# EAGLE design TonESP (EAGLE 7.7.0)
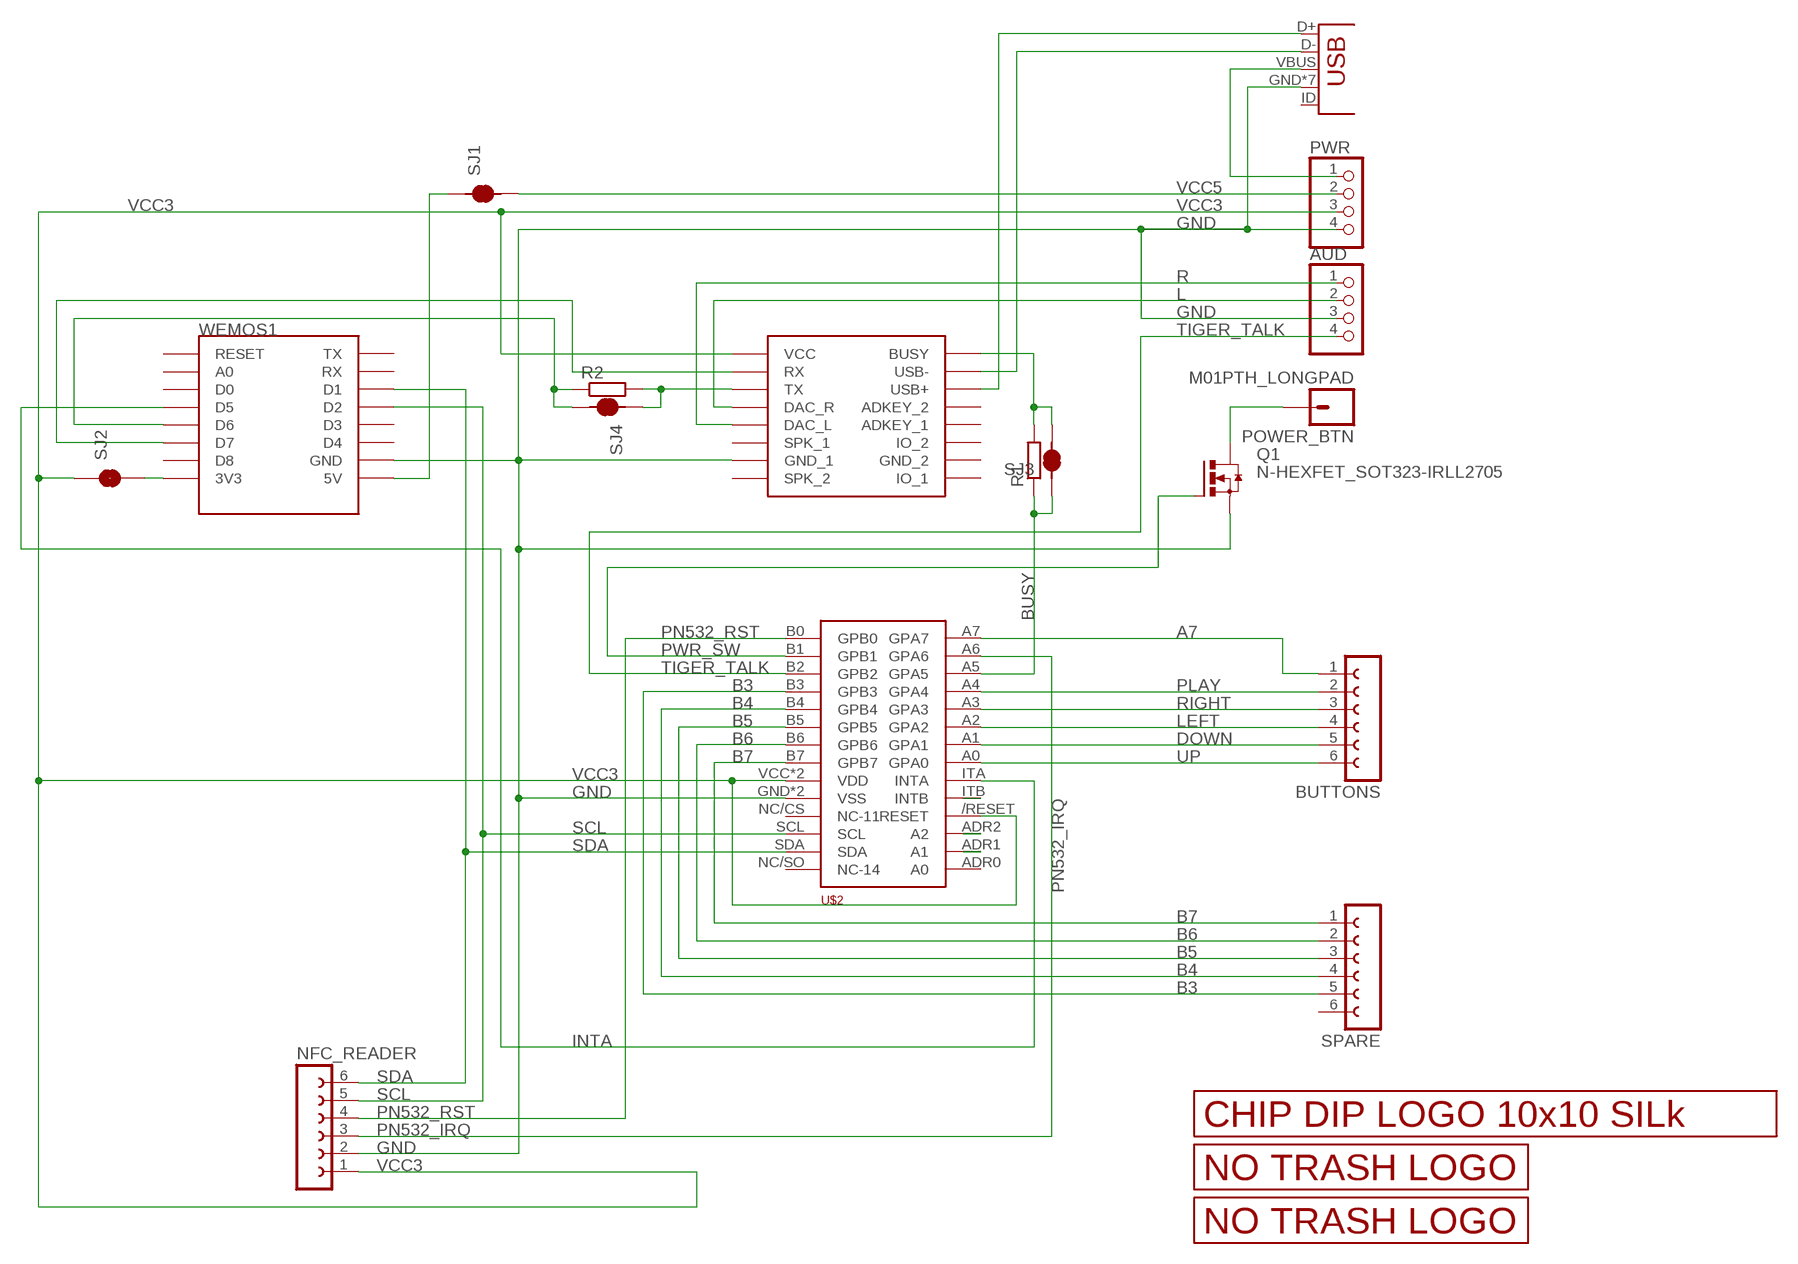
[diagram p0: schematic, sheet 1]

## Parts
AUD  PINHD-1X4  [1X04]
BUTTONS  FE06-1  [FE06]
JP1  USBUSB-MICROB-SMT-DIP  [USB-MICROB-SMT-DIP]
NFC_READER  FE06-1  [FE06]
POWER_BTN  M01PTH_LONGPAD  [1X01_LONGPAD]
PWR  PINHD-1X4  [1X04]
Q1  N-HEXFET_SOT323-IRLL2705  [SOT223]
R1  R-EU_M0805  [M0805]
R2  R-EU_M0805  [M0805]
SJ1  SMD_SJ_2WAY_CLOSEDCLOSED  [SMD_SJ_2WAY_CLOSED]
SJ2  SMD_SJ_2WAY_OPEN  [SMD_SJ_2WAY_OPEN]
SJ3  SMD_SJ_2WAY_CLOSEDCLOSED  [SMD_SJ_2WAY_CLOSED]
SJ4  SMD_SJ_2WAY_CLOSEDCLOSED  [SMD_SJ_2WAY_CLOSED]
SPARE  FE06-1  [FE06]
U$1  DFPLAYER  [DFPLAYER]
U$2  MCP23017-E/SP  [MODULE]
U$4  LOGO_10X10_SILK  [LOGO2_10X10_SILK]
U$5  LOGO_NO_TRASHNO_TRASH  [LOGO_ROHS_NO_TRASH]
U$6  LOGO_NO_TRASHROHS  [LOGO_ROHS_SYM]
WEMOS1  WEMOS-D1-MINITXT  [WEMOS-D1-MINI]

## Nets
A7: BUTTONS.1 U$2.A7(GPA7)
B3: SPARE.5 U$2.B3(GPB3)
B4: SPARE.4 U$2.B4(GPB4)
B5: SPARE.3 U$2.B5(GPB5)
B6: SPARE.2 U$2.B6(GPB6)
B7: SPARE.1 U$2.B7(GPB7)
BUSY: R1.1 SJ3.1 U$2.A5(GPA5)
DOWN: BUTTONS.5 U$2.A1(GPA1)
GND: AUD.3 JP1.GND JP1.MT1(GND) JP1.MT2(GND) JP1.MT3(GND) JP1.MT4(GND) JP1.P$1(GND) JP1.P$2(GND) NFC_READER.2 PWR.4 Q1.3(S) U$1.GND_1 U$2.GND2(VSS) U$2.GND(VSS) WEMOS1.GND
INTA: U$2.ITA(INTA) WEMOS1.D5
L: AUD.2 U$1.DAC_R
LEFT: BUTTONS.4 U$2.A2(GPA2)
N$1: SJ2.3 WEMOS1.3V3
N$3: SJ1.1 WEMOS1.5V
N$4: R1.2 SJ3.3 U$1.BUSY
N$5: R2.2 SJ4.1 U$1.TX
N$6: R2.1 SJ4.3 WEMOS1.D6
N$7: U$1.RX WEMOS1.D7
N$8: POWER_BTN.1 Q1.4(D)
N$9: JP1.VBUS PWR.1
N$11: JP1.D- U$1.USB-
N$12: JP1.D+ U$1.USB+
N$13: U$2.ITB(INTB)
N$14: U$2.ADR2(A2)
N$15: U$2.ADR1(A1)
PLAY: BUTTONS.2 U$2.A4(GPA4)
PN532_IRQ: NFC_READER.3 U$2.A6(GPA6)
PN532_RST: NFC_READER.4 U$2.B0(GPB0)
PWR_SW: Q1.1(G) U$2.B1(GPB1)
R: AUD.1 U$1.DAC_L
RIGHT: BUTTONS.3 U$2.A3(GPA3)
SCL: NFC_READER.5 U$2.SCL WEMOS1.D2
SDA: NFC_READER.6 U$2.SDA WEMOS1.D1
TIGER_TALK: AUD.4 U$2.B2(GPB2)
UP: BUTTONS.6 U$2.A0(GPA0)
VCC3: NFC_READER.1 PWR.3 SJ2.1 U$1.VCC U$2./RESET(RESET) U$2.VCC2(VDD) U$2.VCC(VDD)
VCC5: PWR.2 SJ1.3
Unconnected: JP1.ID SPARE.6 U$1.ADKEY1(ADKEY_1) U$1.ADKEY2(ADKEY_2) U$1.GND_2 U$1.IO1(IO_1) U$1.IO2(IO_2) U$1.SPK1(SPK_1) U$1.SPK2(SPK_2) U$2.ADR0(A0) U$2.NC/CS(NC-11) U$2.NC/SO(NC-14) WEMOS1.A0 WEMOS1.D0 WEMOS1.D3 WEMOS1.D4 WEMOS1.D8 WEMOS1.RESET WEMOS1.RX WEMOS1.TX

## Library data of the parts
AUD PWR = pinhead:PINHD-1X4: PIN HEADER
BUTTONS NFC_READER SPARE = con-lsta:FE06-1: FEMALE HEADER; OC_FARNELL: unknown; OC_NEWARK: unknown
JP1 = JKW_CHIP:USB
POWER_BTN = SparkFun:M01: Header 1 Standard 1-pin 0.1" header. Use with straight break away headers (SKU : PRT-00116), right angle break away headers (PRT-00553), swiss pins (PRT-00743), machine pins (PRT-00117), and female headers (PRT-00115).
Q1 = transistor-power:N-HEXFET_?-*: HEXFET® Power MOSFET
R1 R2 = resistor:R-EU_: RESISTOR, European symbol
SJ1 SJ3 SJ4 = JKW_CHIP:SMD_SJ_2WAY_CLOSED: Solder Jumper 2 way solder jumper
SJ2 = JKW_CHIP:SMD_SJ_2WAY_OPEN: Solder Jumper 2 way solder jumper
U$1 = DFPlayer_v1:DFPLAYER
U$2 = IO-Expanders:MCP23017-E/SP: MCP23017 16 pin IO Expander using I2C bus
U$4 = JKW_CHIP:LOGO_10X10_SILK
U$5 U$6 = JKW_CHIP:LOGO_NO_TRASH
WEMOS1 = esp8266modules:WEMOS-D1-MINI: WeMos.cc D1 mini ESP8266 module

## Board
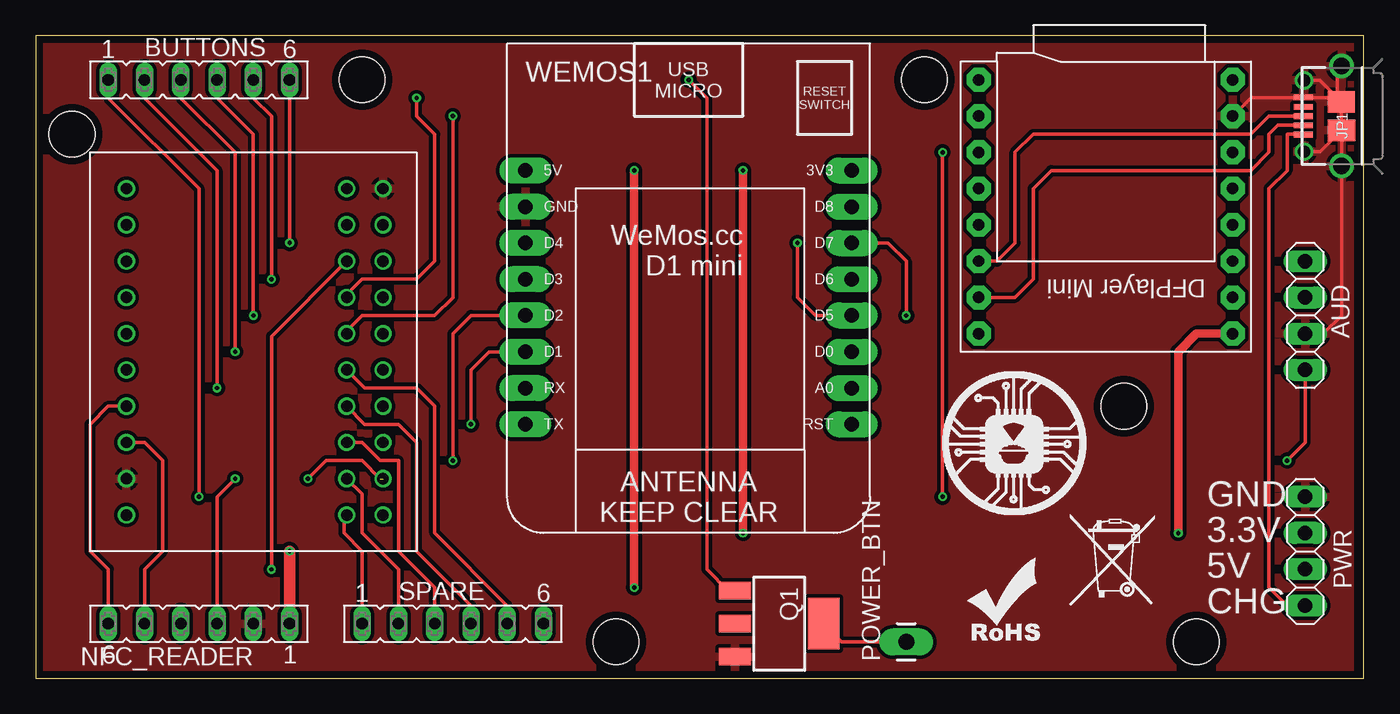
[diagram p1: board, top side]
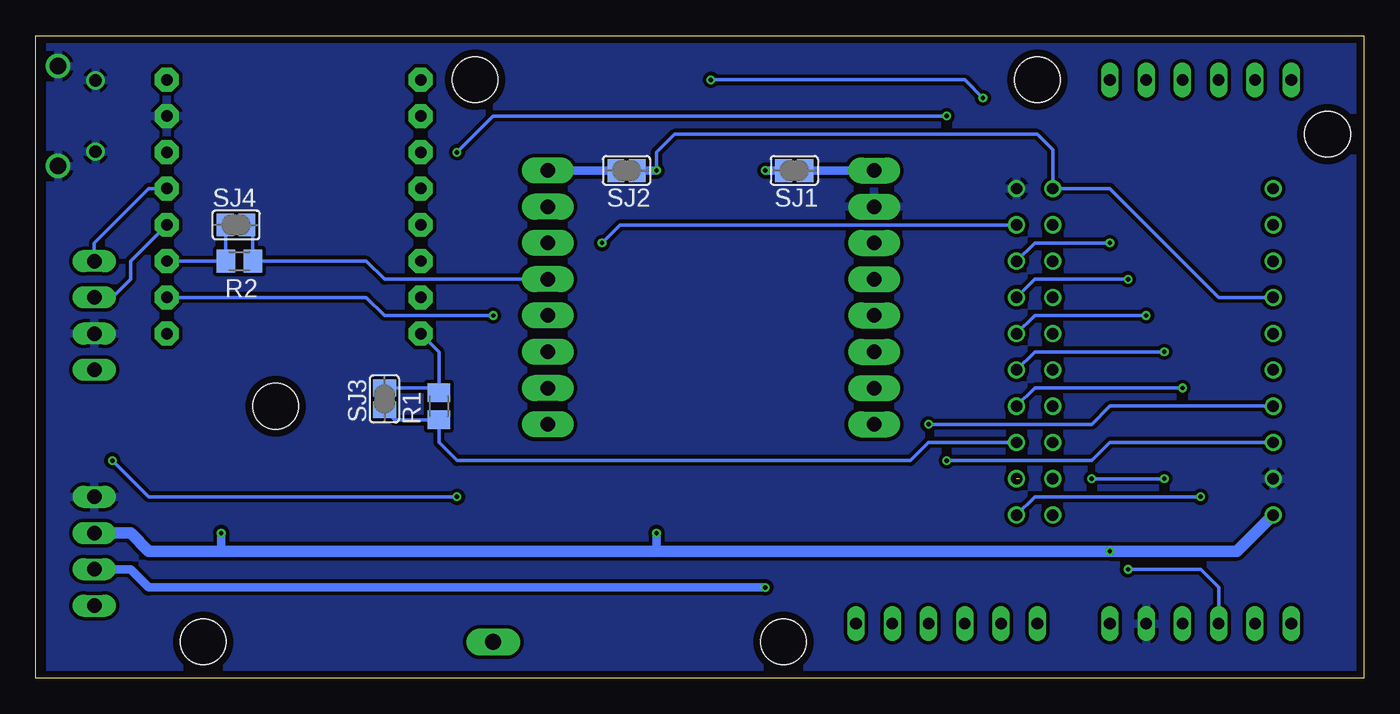
[diagram p2: board, bottom side, seen from below]

Size 93 x 45 mm. Coordinates in mm from the lower left corner, seen from the top.
Outline: 0,0 93,0 93,45 0,45 0,0
Copper layers (1*16): Top 0.035mm / dielectric 1.6mm / Bottom 0.035mm
Design rules "Elecrow_2-layer_PCB_eagle_rule": minimum track width 6mil, minimum drill 12mil, track to track 6mil, track to pad 6mil, pad to pad 6mil, via to via 8mil, smd to smd 0mil, copper to edge 20mil, drill to drill 10mil, minimum pad ring 6mil, minimum via ring 6mil, stop-mask expansion 0mil, vias tented up to drill 100mil, thermal gap 10mil
Holes 3.2 mm at 81.28,2.54 40.64,2.54 62.23,41.91 22.86,41.91 2.54,38.1 76.2,19.05

### Footprints (pad centres in the part's own frame; a part is rotated, then mirrored left to right if it is on the bottom)
1X04 = drill 1.016 long: 1 -3.81,0; 2 -1.27,0; 3 1.27,0; 4 3.81,0
FE06 = drill 0.813 long: 1 -6.35,0; 2 -3.81,0; 3 -1.27,0; 4 1.27,0; 5 3.81,0; 6 6.35,0
USB-MICROB-SMT-DIP = smd 0.4 x 1.35: D+ 0,2.675; D- -0.65,2.675; GND 1.3,2.675; ID 0.65,2.675; VBUS -1.3,2.675 | drill 1.15 pad 1.7: MT1 -3.5,0; MT2 3.5,0 | drill 0.85 pad 1.25: MT3 -2.5,2.625; MT4 2.5,2.625 | smd 1.5 x 1.9: P$1 -1,0; P$2 1,0.01
1X01_LONGPAD = drill 1.118 pad 1.88 long: 1 0,0
SOT223 = smd 1.219 x 2.235: 1 -2.311,-3.099; 2 0,-3.099; 3 2.311,-3.099 | smd 3.6 x 2.2: 4 0,3.099
M0805 = smd 1.3 x 1.6: 1 -0.95,0; 2 0.95,0
SMD_SJ_2WAY_CLOSED = smd 1.168 x 1.6: 1 -1.524,0; 3 0,0
SMD_SJ_2WAY_OPEN = smd 1.168 x 1.6: 1 -1.524,0; 3 0,0
DFPLAYER = drill 0.8 pad 1.676 octagon: ADKEY1 8.89,-1.27; ADKEY2 8.89,1.27; BUSY 8.89,8.89; DAC_L -8.89,-1.27; DAC_R -8.89,1.27; GND_1 -8.89,-6.35; GND_2 8.89,-6.35; IO1 8.89,-8.89; IO2 8.89,-3.81; RX -8.89,6.35; SPK1 -8.89,-3.81; SPK2 -8.89,-8.89; TX -8.89,3.81; USB+ 8.89,3.81; USB- 8.89,6.35; VCC -8.89,8.89
MODULE = drill 0.8: /RESET 0,0; A0 17.966,2.54; A1 17.966,0; A2 17.966,-2.54; A3 17.966,-5.08; A4 17.966,-7.62; A5 17.966,-10.16; A6 17.966,-12.7; A7 17.966,-15.24; ADR0 0,2.54; ADR1 0,5.08; ADR2 0,7.62; B0 15.426,2.54; B1 15.426,0; B2 15.426,-2.54; B3 15.426,-5.08; B4 15.426,-7.62; B5 15.426,-10.16; B6 15.426,-12.7; B7 15.426,-15.24; GND 0,-12.7; GND2 17.966,7.62; ITA 17.966,5.08; ITB 15.426,5.08; NC/CS 0,-5.08; NC/SO 0,-2.54; SCL 0,-10.16; SDA 0,-7.62; VCC 0,-15.24; VCC2 15.426,7.62
WEMOS-D1-MINI = drill 1.016 pad 1.829 long: 3V3 -10.16,-10.16; 5V 12.7,-10.16; A0 -10.16,5.08; D0 -10.16,2.54; D1 12.7,2.54; D2 12.7,0; D3 12.7,-2.54; D4 12.7,-5.08; D5 -10.16,0; D6 -10.16,-2.54; D7 -10.16,-5.08; D8 -10.16,-7.62; GND 12.7,-7.62; RESET -10.16,7.62; RX 12.7,5.08; TX 12.7,7.62

### Placement (x,y rotation side)
AUD  88.9,25.4 270 top
BUTTONS  11.43,41.91 0 top
JP1  91.44,39.37 90 top
NFC_READER  11.43,3.81 180 top
POWER_BTN  60.96,2.54 90 top
PWR  88.9,8.89 90 top
Q1  52.07,3.81 270 top
R1  64.77,19.05 90 bottom
R2  78.74,29.21 180 bottom
SJ1  40.64,35.56 180 bottom
SJ2  52.39,35.56 180 bottom
SJ3  68.58,20.32 90 bottom
SJ4  78.21,31.75 0 bottom
SPARE  29.21,3.81 0 top
U$1  74.93,33.02 180 top
U$2  6.35,26.67 0 top
U$4  63.5,11.43 0 top
U$5  72.39,5.08 0 top
U$6  64.77,2.54 0 top
WEMOS1  46.99,25.4 180 top

### Tracks (layer width: path | path; a pad name or v marks a point on that pad's centre or on a via)
A7  (via drill 0.3)
  Top 0.254: BUTTONS.1 5.08,40.64 11.43,34.29 v11.43,12.7
  Bottom 0.254: v11.43,12.7 23.05,12.7 U$2.A7
B3
  Top 0.254: SPARE.5 33.02,5.08 27.94,10.16 27.94,19.05 26.67,20.32 23.05,20.32 U$2.B3
B4
  Top 0.254: SPARE.4 30.48,5.08 26.67,8.89 26.67,16.51 25.4,17.78 23.05,17.78 U$2.B4
B5
  Top 0.254: SPARE.3 27.94,6.35 25.4,8.89 25.4,15.24 24.13,15.24 22.86,16.51 U$2.B5
B6
  Top 0.254: SPARE.2 25.4,7.62 22.86,10.16 22.86,12.89 U$2.B6
B7
  Top 0.254: SPARE.1 22.86,8.89 21.59,10.16 21.59,11.24 U$2.B7
BUSY
  Bottom 0.254: U$2.A5 30.48,16.51 31.75,15.24 63.5,15.24 64.77,16.51 R1.1 67.88,18.1 SJ3.1
DOWN  (via drill 0.3)
  Top 0.254: BUTTONS.5 15.24,40.64 16.51,39.37 v16.51,27.94
  Bottom 0.254: v16.51,27.94 23.05,27.94 U$2.A1
GND
  Top 0.254: U$1.GND_1 85.12,40.67 JP1.GND 91.13,40.67 | 91.13,40.67 JP1.P$2 | 91.13,40.67 91.13,42.56 JP1.MT2 | JP1.MT4 89.93,41.87 JP1.P$2 | JP1.P$2 JP1.P$1 | JP1.P$1 JP1.MT1 91.44,25.4 90.17,24.13 AUD.3 | JP1.MT3 89.94,36.87 JP1.P$1
  pour Bottom (isolate 0.254): 0,45 92,45 92,0 0,0
  pour Top (isolate 0.254): 0,45 92,45 92,0 0,0
INTA  (via drill 0.3)
  Top 0.254: v53.34,30.48 53.34,26.67 54.61,25.4 WEMOS1.D5
  Bottom 0.254: U$2.ITA 52.07,31.75 v53.34,30.48
L
  Bottom 0.254: U$1.DAC_R 86.36,29.21 86.36,27.94 87.63,26.67 AUD.2
LEFT  (via drill 0.3)
  Top 0.254: BUTTONS.4 12.7,40.64 15.24,38.1 v15.24,25.4
  Bottom 0.254: v15.24,25.4 23.05,25.4 U$2.A2
N$1
  Bottom 0.61: WEMOS1.3V3 SJ2.3
N$3
  Bottom 0.61: WEMOS1.5V SJ1.1
N$4
  Bottom 0.254: SJ3.3 65.09,20.32 R1.2 64.77,22.86 U$1.BUSY
N$5
  Bottom 0.254: U$1.TX R2.2 79.69,30.44 SJ4.1
N$6
  Bottom 0.254: SJ4.3 77.79,31.33 R2.1 69.85,29.21 68.58,27.94 WEMOS1.D6
N$7  (via drill 0.3)
  Top 0.254: WEMOS1.D7 59.69,30.48 60.96,29.21 v60.96,25.4
  Bottom 0.254: v60.96,25.4 68.58,25.4 69.85,26.67 U$1.RX
N$8
  Top 0.254: Q1.4 56.44,2.54 POWER_BTN.1
N$9
  Top 0.254: JP1.VBUS 88.73,38.1 87.63,38.1 87.63,35.56 86.36,34.29 86.36,6.35 87.63,5.08 PWR.1
N$11
  Top 0.254: U$1.USB- 68.58,26.67 69.85,27.94 69.85,34.29 71.12,35.56 85.09,35.56 86.36,36.83 86.36,38.1 86.98,38.72 JP1.D-
N$12
  Top 0.254: U$1.USB+ 67.31,29.21 68.58,30.48 68.58,36.83 69.85,38.1 85.09,38.1 86.36,39.37 JP1.D+
PLAY  (via drill 0.3)
  Top 0.254: BUTTONS.2 7.62,40.64 12.7,35.56 v12.7,20.32
  Bottom 0.254: v12.7,20.32 23.05,20.32 U$2.A4
PN532_IRQ  (via drill 0.3)  (1 unrouted)
  Top 0.254: NFC_READER.3 12.7,12.7 v13.97,13.97 | v19.05,13.97 20.32,15.24 22.86,15.24 24.13,13.97
  Bottom 0.254: v13.97,13.97 v19.05,13.97
PN532_RST  (via drill 0.3)
  Top 0.254: v16.51,7.62 16.51,23.94 U$2.B0
  Bottom 0.254: NFC_READER.4 10.16,6.35 11.43,7.62 v16.51,7.62
PWR_SW  (via drill 0.3)
  Top 0.254: U$2.B1 21.78,26.86 22.86,27.94 26.67,27.94 27.94,29.21 27.94,38.1 26.67,39.37 v26.67,40.64 | Q1.1 48.49,6.12 46.99,7.62 46.99,40.64 v45.72,41.91
  Bottom 0.254: v26.67,40.64 27.94,41.91 v45.72,41.91
R
  Bottom 0.254: U$1.DAC_L 85.09,34.29 88.9,30.48 AUD.1
RIGHT  (via drill 0.3)
  Top 0.254: BUTTONS.3 10.16,40.64 13.97,36.83 v13.97,22.86
  Bottom 0.254: v13.97,22.86 23.05,22.86 U$2.A3
SCL  (via drill 0.3)
  Top 0.254: v29.21,15.24 29.21,24.13 30.48,25.4 WEMOS1.D2 | NFC_READER.5 7.62,7.62 8.89,8.89 8.89,15.24 7.62,16.51 U$2.SCL
  Bottom 0.254: U$2.SCL 17.78,16.51 19.05,15.24 v29.21,15.24
SDA  (via drill 0.3)
  Top 0.254: v30.48,17.78 30.48,21.59 31.75,22.86 WEMOS1.D1 | NFC_READER.6 5.08,7.62 3.81,8.89 3.81,17.78 5.08,19.05 U$2.SDA
  Bottom 0.254: U$2.SDA 17.78,19.05 19.05,17.78 v30.48,17.78
TIGER_TALK  (via drill 0.3)
  Top 0.254: U$2.B2 21.78,24.32 22.86,25.4 27.94,25.4 29.21,26.67 v29.21,39.37 | v63.5,36.83 v63.5,12.7 | v87.63,15.24 88.9,16.51 AUD.4
  Bottom 0.254: v29.21,39.37 60.96,39.37 v63.5,36.83 | v63.5,12.7 85.09,12.7 v87.63,15.24
UP  (via drill 0.3)
  Top 0.254: BUTTONS.6 v17.78,30.48
  Bottom 0.254: v17.78,30.48 23.05,30.48 U$2.A0
VCC3  (via drill 0.3)
  Top 0.61: v49.53,35.56 v49.53,10.16 | U$1.VCC 81.28,24.13 80.01,22.86 v80.01,10.16
  Top 0.813: NFC_READER.1 v17.78,8.89
  Bottom 0.254: v49.53,35.56 49.53,36.83 48.26,38.1 22.86,38.1 21.78,37.02 U$2.VCC2 17.78,34.29 10.16,26.67 U$2./RESET
  Bottom 0.61: SJ2.1 v49.53,35.56 | v49.53,10.16 49.53,8.89 | v80.01,10.16 80.01,8.89
  Bottom 0.813: PWR.3 86.36,10.16 85.09,8.89 80.01,8.89 49.53,8.89 v17.78,8.89 8.89,8.89 U$2.VCC
VCC5  (via drill 0.3)
  Top 0.61: v41.91,35.56 v41.91,6.35
  Bottom 0.61: SJ1.3 v41.91,35.56 | v41.91,6.35 85.09,6.35 86.36,7.62 PWR.2

### Text on the board
tPlace: GND | 3.3V | 5V | CHG